# Altium schematic sheet FPGA_CLKs.SchDoc
size A3 portrait; PageSetup: Record=PageOptions|CenterHorizontal=True|CenterVertical=True|PrintScale=1.00|XCorrection=1.00|YCorrection=1.00|PrintKind=1|BorderSize=5000000|LeftOffset=0|BottomOffset=0|Orientation=1|PaperLength=1000|PaperWidth=1000|Scale=100|PaperSource=7|PrintQuality=-4|MediaType=1|DitherType=10|PaperKind=A4|PrintScaleMode=1
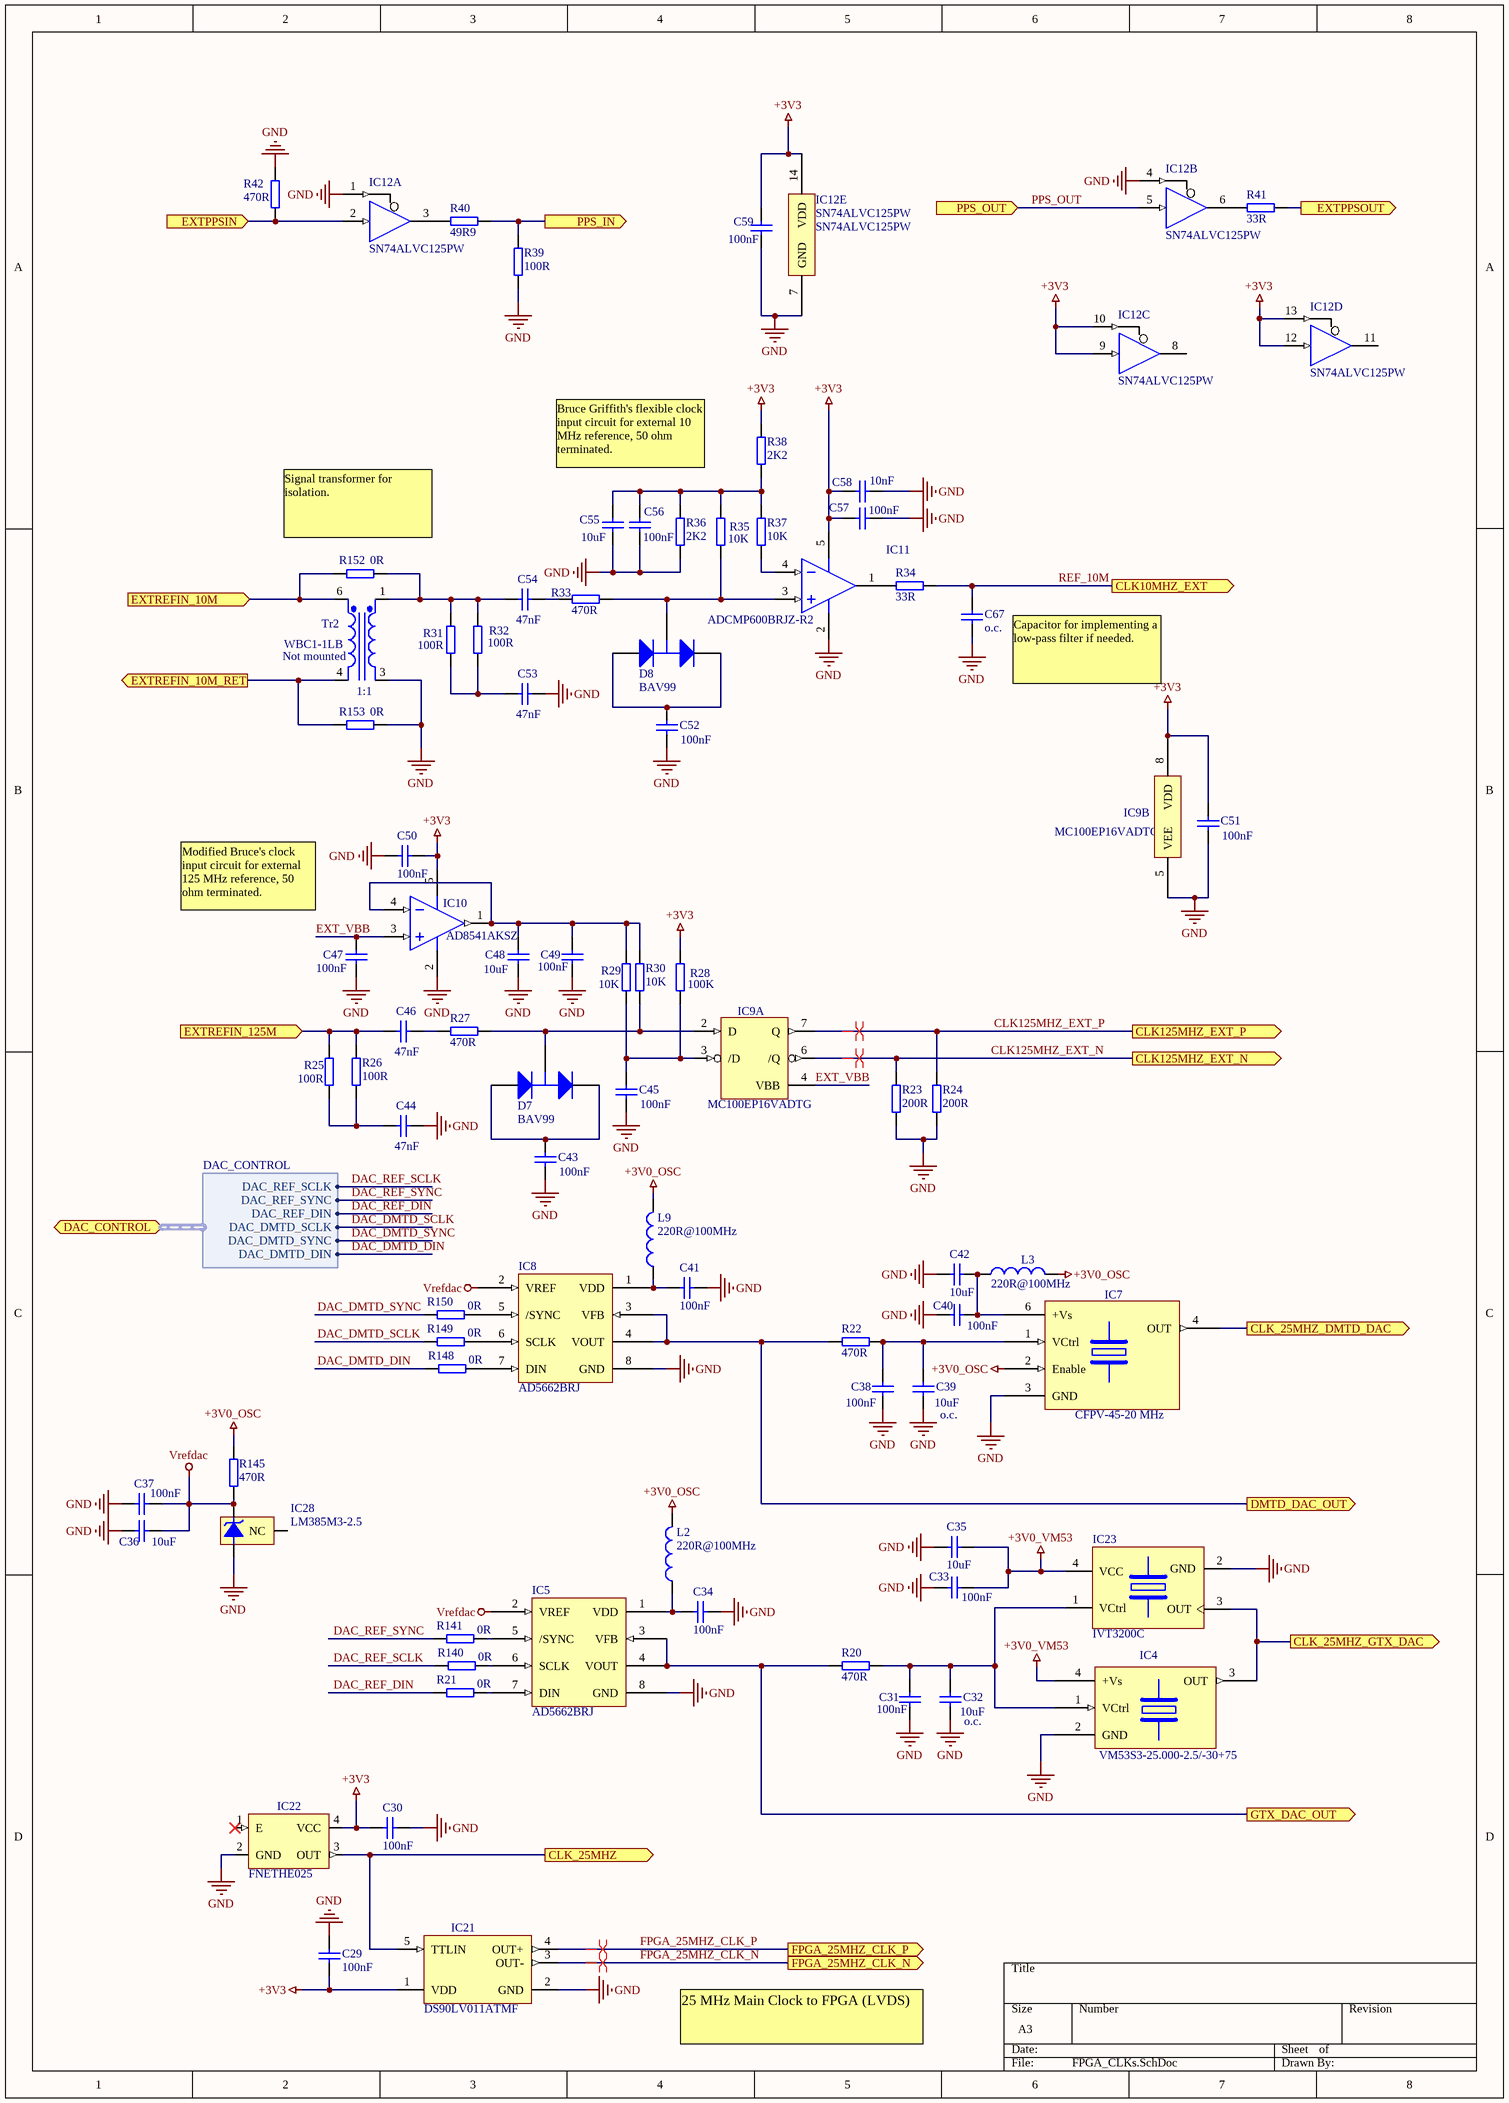
[diagram p0: FPGA_CLKs.SchDoc]

## Parts
C29  100nF  [CC1005-0402]
C30  100nF  [CC1005-0402]
C31  100nF  [CC1005-0402]
C32  10uF  value o.c.  [CC1608-0603]
C33  100nF  [CC1005-0402]
C34  100nF  [CC1005-0402]
C35  10uF  [CC1608-0603]
C36  10uF  [CC1608-0603]
C37  100nF  [CC1005-0402]
C38  100nF  [CC1005-0402]
C39  10uF  value o.c.  [CC1608-0603]
C40  100nF  [CC1005-0402]
C41  100nF  [CC1005-0402]
C42  10uF  [CC1608-0603]
C43  100nF  [CC1005-0402]
C44  47nF  [CC1005-0402]
C45  100nF  [CC1005-0402]
C46  47nF  [CC1005-0402]
C47  100nF  [CC1005-0402]
C48  10uF  [CC1608-0603]
C49  100nF  [CC1005-0402]
C50  100nF  [CC1005-0402]
C51  100nF  [CC1005-0402]
C52  100nF  [CC1005-0402]
C53  47nF  [CC1005-0402]
C54  47nF  [CC1005-0402]
C55  10uF  [CC1608-0603]
C56  100nF  [CC1005-0402]
C57  100nF  [CC1005-0402]
C58  10nF  [CC1005-0402]
C59  100nF  [CC1005-0402]
C67  o.c.  [CC1608-0603]
D7  BAV99  [SOT-23]
D8  BAV99  [SOT-23]
IC4  VM53S3-25.000-2.5/-30+75  [VCTCXO_VM53S]
IC5  value AD5662BRJ  [SOT23-8]  (hidden comment: AD5662B)
IC7  CFPV-45-20 MHz  [vs-705]
IC8  value AD5662BRJ  [SOT23-8]  (hidden comment: AD5662B)
IC9  value MC100EP16VADTG  [TSOP65P490-8AN]  (hidden comment: MC100EP16)  (parts A,B of 2)
IC10  AD8541AKSZ  [SOT65P210X110-5N]
IC11  ADCMP600BRJZ-R2  [SOT23-5AL]
IC12  SN74ALVC125PW  [PW014]  (parts A,B,C,D,E of 5)
IC21  DS90LV011ATMF  [MF05A_N]
IC22  FNETHE025  [SPXO]
IC23  IVT3200C  [OSC_RAKON_IVT3200C]
IC28  LM385M3-2.5  [MF03A_N]
L2  Impedance: 220R@100MHz  [0603]  (hidden comment: 220R@100MHz Ferrite Bead)
L3  Impedance: 220R@100MHz  [0603]  (hidden comment: 220R@100MHz Ferrite Bead)
L9  Impedance: 220R@100MHz  [0603]  (hidden comment: 220R@100MHz Ferrite Bead)
R20  470R  [0402]
R21  0R  [0603]
R22  470R  [0402]
R23  200R  [0402]
R24  200R  [0402]
R25  100R  [0402]
R26  100R  [0402]
R27  470R  [0402]
R28  100K  [0402]
R29  10k  [0402]
R30  10k  [0402]
R31  100R  [0402]
R32  100R  [0402]
R33  470R  [0402]
R34  33R  [0603]
R35  10k  [0402]
R36  2K2  [0402]
R37  10k  [0402]
R38  2K2  [0402]
R39  100R  [0402]
R40  49R9  [0603]
R41  33R  [0603]
R42  470R  [0402]
R140  0R  [0603]
R141  0R  [0603]
R145  470R  [0402]
R148  0R  [0603]
R149  0R  [0603]
R150  0R  [0603]
R152  value 0R  [0402]  (hidden comment: Jumper)
R153  value 0R  [0402]  (hidden comment: Jumper)
Tr2  WBC1-1LB  value 1:1  Mounted: Not mounted  [SMT6P150P]

## Ports
CLK10MHZ_EXT (out), CLK125MHZ_EXT_N (out), CLK125MHZ_EXT_P (out), CLK_25MHZ (out), CLK_25MHZ_DMTD_DAC (out), CLK_25MHZ_GTX_DAC (out), DAC_CONTROL (harness DAC_CONTROL), DMTD_DAC_OUT (out), EXTPPSIN (in), EXTPPSOUT (out), EXTREFIN_10M (in), EXTREFIN_10M_RET (out), EXTREFIN_125M (in), FPGA_25MHZ_CLK_N (out), FPGA_25MHZ_CLK_P (out), GTX_DAC_OUT (out), PPS_IN (out), PPS_OUT (in)

## Harnesses
DAC_CONTROL: DAC_DMTD_DIN, DAC_DMTD_SYNC, DAC_DMTD_SCLK, DAC_REF_DIN, DAC_REF_SYNC, DAC_REF_SCLK

## Nets
+3V0_OSC: IC7.2(Enable) L2.2 L3.2 L9.2 R145.2
+3V0_VM53: C33.1 C35.1 IC4.4(+Vs) IC23.4(VCC)
+3V3: C29.2 C30.2 C50.1 C51.2 C57.2 C58.2 C59.2 IC9.8(VDD) IC10.5(V+) IC11.5(VCC/VCCO) IC12.9(B) IC12.10(~{A}) IC12.12(B) IC12.13(~{A}) IC12.14(VDD) IC21.1(VDD) IC22.4(VCC) R28.2 R38.2
GND: C29.1 C30.1 C31.1 C32.1 C33.2 C34.1 C35.2 C36.1 C37.2 C38.1 C39.1 C40.2 C41.1 C42.2 C43.1 C44.2 C45.1 C47.1 C48.1 C49.1 C50.2 C51.1 C52.1 C53.2 C55.1 C56.1 C57.1 C58.1 C59.1 C67.1 IC4.2(GND) IC5.8(GND) IC7.3(GND) IC8.8(GND) IC9.5(VEE) IC10.2(V-) IC11.2(VEE) IC12.1(~{A}) IC12.4(~{A}) IC12.7(GND) IC21.2(GND) IC22.2(GND) IC23.2(GND) IC28.2(-V) R23.1 R24.1 R36.1 R39.1 R42.2 R153.1 Tr2.3(Sec-)
Vrefdac: C36.2 C37.1 IC5.2(VREF) IC8.2(VREF) IC28.1(+V) R145.1
CLK125MHZ_EXT_N: IC9.6(/Q) R23.2 ; port CLK125MHZ_EXT_N
CLK125MHZ_EXT_P: IC9.7(Q) R24.2 ; port CLK125MHZ_EXT_P
CLK_25MHZ: IC21.5(TTLIN) IC22.3(OUT) ; port CLK_25MHZ
CLK_25MHZ_DMTD_DAC: IC7.4(OUT) ; port CLK_25MHZ_DMTD_DAC
CLK_25MHZ_GTX_DAC: IC4.3(OUT) IC23.3(OUT) ; port CLK_25MHZ_GTX_DAC
DAC_DMTD_DIN: R148.2 ; port DAC_CONTROL.DAC_DMTD_DIN
DAC_DMTD_SCLK: R149.2 ; port DAC_CONTROL.DAC_DMTD_SCLK
DAC_DMTD_SYNC: R150.2 ; port DAC_CONTROL.DAC_DMTD_SYNC
DAC_REF_DIN: R21.2 ; port DAC_CONTROL.DAC_REF_DIN
DAC_REF_SCLK: R140.2 ; port DAC_CONTROL.DAC_REF_SCLK
DAC_REF_SYNC: R141.2 ; port DAC_CONTROL.DAC_REF_SYNC
DMTD_DAC_OUT: IC8.3(VFB) IC8.4(VOUT) R22.1 ; port DMTD_DAC_OUT
EXT_VBB: C47.2 IC9.4(VBB) IC10.3(IN+)
EXTPPSIN: IC12.2(B) R42.1 ; port EXTPPSIN
EXTPPSOUT: R41.2 ; port EXTPPSOUT
EXTREFIN_10M: R152.2 Tr2.6(Pri+) ; port EXTREFIN_10M
EXTREFIN_10M_RET: R153.2 Tr2.4(Pri-) ; port EXTREFIN_10M_RET
EXTREFIN_125M: C46.1 R25.2 R26.2 ; port EXTREFIN_125M
FPGA_25MHZ_CLK_N: IC21.3(OUT-) ; port FPGA_25MHZ_CLK_N
FPGA_25MHZ_CLK_P: IC21.4(OUT+) ; port FPGA_25MHZ_CLK_P
GTX_DAC_OUT: IC5.3(VFB) IC5.4(VOUT) R20.1 ; port GTX_DAC_OUT
PPS_IN: R39.2 R40.2 ; port PPS_IN
PPS_OUT: IC12.5(B) ; port PPS_OUT
REF_10M: C67.2 R34.2 ; port CLK10MHZ_EXT
NetC31_2: C31.2 C32.2 IC4.1(VCtrl) IC23.1(VCtrl) R20.2
NetC34_2: C34.2 IC5.1(VDD) L2.1
NetC38_2: C38.2 C39.2 IC7.1(VCtrl) R22.2
NetC40_1: C40.1 C42.1 IC7.6(+Vs) L3.1
NetC41_2: C41.2 IC8.1(VDD) L9.1
NetC43_2: C43.2 D7.1(A) D7.2(K)
NetC44_1: C44.1 R25.1 R26.1
NetC45_2: C45.2 IC9.3(/D) R28.1 R29.1
NetC46_2: C46.2 R27.1
NetC48_2: C48.2 C49.2 IC10.1(OUT) IC10.4(IN-) R29.2 R30.2
NetC52_2: C52.2 D8.1(A) D8.2(K)
NetC53_1: C53.1 R31.1 R32.1
NetC54_1: C54.1 R31.2 R32.2 R152.1 Tr2.1(Sec+)
NetC54_2: C54.2 R33.1
NetC55_2: C55.2 C56.2 R35.2 R36.2 R37.2 R38.1
NetD7_3: D7.3(C) IC9.2(D) R27.2 R30.1
NetD8_3: D8.3(C) IC11.3(VP) R33.2 R35.1
NetIC5_5: IC5.5(/SYNC) R141.1
NetIC5_6: IC5.6(SCLK) R140.1
NetIC5_7: IC5.7(DIN) R21.1
NetIC8_5: IC8.5(/SYNC) R150.1
NetIC8_6: IC8.6(SCLK) R149.1
NetIC8_7: IC8.7(DIN) R148.1
NetIC11_1: IC11.1(Q) R34.1
NetIC11_4: IC11.4(VN) R37.1
NetIC12_3: IC12.3(Y) R40.1
NetIC12_6: IC12.6(Y) R41.1

Not connected (* = marked no-connect by the designer): IC12 8(Y) 11(Y); IC22 1(E)*; IC28 3(NC)

## Layout directives
differential pair: CLK125MHZ_EXT_N, CLK125MHZ_EXT_P, FPGA_25MHZ_CLK_N, FPGA_25MHZ_CLK_P

## Notes on the sheet
- Bruce Griffith's flexible clock input circuit for external 10 MHz reference, 50 ohm terminated.
- (near R152) Signal transformer for isolation.
- (near C67) Capacitor for implementing a low-pass filter if needed.
- Modified Bruce's clock input circuit for external 125 MHz reference, 50 ohm terminated.
- 25 MHz Main Clock to FPGA (LVDS)

## Library data of the parts
C29-C31 C33 C34 C37 C38 C40 C41 C43 C45 C47 C49-C52 C56 C57 C59 = CC0402_100NF_16V_10%_X7R: Capacitor; Manufacturer1: TDK; Manufacturer1 PN: C1005X7R1C104K; TC: X7R; Tolerance: ±10%; Voltage: 16V; Published: 8-Jun-2000; LatestRevisionDate: 17-Jul-2002; LatestRevisionNote: Re-released for DXP Platform.; PackageReference: RAD-0.3; Publisher: Altium Limited; Distributor1: Digikey; Distributor1 PN: 445-4952-1-ND; Case: 0402; Value: 100nF
C32 C35 C36 C39 C42 C48 C55 = CC0603_10UF_6.3V_20%_X5R: Capacitor; Manufacturer1: TDK; Manufacturer1 PN: C1608X5R0J106M; TC: X5R; Tolerance: ±20%; Voltage: 6.3V; Published: 8-Jun-2000; LatestRevisionDate: 17-Jul-2002; LatestRevisionNote: Re-released for DXP Platform.; PackageReference: RAD-0.3; Publisher: Altium Limited; Distributor1: Digikey; Distributor1 PN: 445-4112-1-ND; Case: 0603
  C35 C36 C42 C48 C55: Value: 10uF
C44 C46 C53 C54 = CC0402_47NF_25V_10%_X7R: Capacitor; Manufacturer1: TDK; Manufacturer1 PN: C1005X7R1E473K; TC: X7R; Tolerance: ±10%; Voltage: 25V; Published: 8-Jun-2000; LatestRevisionDate: 17-Jul-2002; LatestRevisionNote: Re-released for DXP Platform.; PackageReference: RAD-0.3; Publisher: Altium Limited; Distributor1: Digikey; Distributor1 PN: 445-4941-1-ND; Case: 0402; Value: 47nF
C58 = CC0402_10NF_25V_10%_X7R: Capacitor; Manufacturer1: TDK; Manufacturer1 PN: C1005X7R1E103K; TC: X7R; Tolerance: ±10%; Voltage: 25V; Published: 8-Jun-2000; LatestRevisionDate: 17-Jul-2002; LatestRevisionNote: Re-released for DXP Platform.; PackageReference: RAD-0.3; Publisher: Altium Limited; Distributor1: Digikey; Distributor1 PN: 445-1260-1-ND; Case: 0402; Value: 10nF
C67 = CC0603_O.C.: Capacitor; Manufacturer1: Phycomp; TC: X7R; Tolerance: ±10%; Voltage: 16V; Published: 8-Jun-2000; LatestRevisionDate: 17-Jul-2002; LatestRevisionNote: Re-released for DXP Platform.; PackageReference: RAD-0.3; Publisher: Altium Limited; Manufacturer1 PN: *; Distributor1: Digikey; Distributor1 PN: *; Case: 0402; Value: o.c.
D7 D8 = BAV99: Silicon Switching Diode Array for High-Speed Switching; RefId: 1081211; Published: 21-Mar-2003; DatasheetDocument: Oct-1999; PackageDocument: Sep-2001; PackageReference: SOT-23; Publisher: Altium Limited; ComponentLink1Description: Manufacturer Link; ComponentLink1URL: http://www.infineon.com/; ComponentLink2Description: Datasheet; ComponentLink2URL: http://www.infineon.com/upload/Document/cmc_upload/documents/080/631/bav99series_1.pdf; Supplier: Farnell; Value: BAV99
IC4 = VCTCXO_VM53S: VCTCXO oscillator; Manufacturer1: MEC; Distributor1: RS; Distributor1 PN: 672-0797
IC5 IC8 = AD5662BRJ: Analog Devices 16-bit DAC w/SPI interface, ext ref; RefId: AD5662BRJZ-2REEL7DKR-ND; Supplier: Digikey
IC7 = VCXO_CFPV_45: VCXO oscillator; Manufacturer: IQD Frequency; Manufacturer PN: LFVCXO026156; Distributor1: Farnell; Distributor1 PN: 1674677
IC9 = MC100EP16: ONSemi differental receiver w/ECL output; RefId: 1607606; Supplier: Farnell
IC10 = AD8541: Analog Devices general purpose low-voltage R2R CMOS opamp; Value: AD8541AKSZ; Distributor1: Digikey; Distributor1 PN: AD8541AKSZ-REEL7CT-ND
IC11 = ADCMP600: Analog Devices fast comparator; RefId: 1441023; Supplier: Farnell; Value: ADCMP600BRJZ-R2
IC12 = SN74ALVC125PW: Quad Buffer with 3-State Outputs with TTL Compatible Inputs; Manufacturer1: Texas Instruments; Value: SN74ALVC125PW; Manufacturer1 PN: SN74ALVC125PW; Distributor1: Digikey; Distributor1 PN: 296-26434-5-ND; Case: PW14
IC21 = DS90LV011ATMF: Single High Speed Differential Driver; Manufacturer: National Semiconductor; CompType: Interface IC; PackageTopMarking: N01*XTT; PowerWise: N; Published: 4-Dec-2008; DatasheetVersion: May-2002; PackageVersion: revD, Aug-2008; PackageReference: MF05A; Publisher: Altium Limited; PackageDescription: Molded SOT-23, .115 x .063 x .040in Body, 5 Lead, .0375in Pitch; PartNumber: DS90LV011ATMF; RoHS: O; PinCount: 5; DigiKeyPartNumber: DS90LV011ATMFTR-ND; ComponentLink1Description: DS90LV011A Datasheet; ComponentLink1URL: http://www.national.com/ds/DS/DS90LV011A.pdf; ComponentLink2Description: DS90LV011A Web Page; ComponentLink2URL: http://www.national.com/pf/DS/DS90LV011A.html; ComponentLink3Description: MF05A Package Page; ComponentLink3URL: http://www.national.com/packaging/folders/mf05a.html
IC22 = OSC_CFPS-73: SMD oscillator 3.3V (Elfa); Value: FNETHE025; Distributor: Digikey; Distributor PN: FNETHE025CT-ND
IC23 = IVT32000C
IC28 = LM385M3-2.5: Micropower Voltage Reference Diode; Manufacturer: National Semiconductor; CompType: Voltage Reference IC; PackageTopMarking: R12*XTT; Published: 4-Dec-2008; DatasheetVersion: Jan-2008; PackageVersion: revB, Mar-2003; PackageReference: MF03A; Publisher: Altium Limited; PackageDescription: Molded SOT-23, .115 x .051 x .037in Body, 3 Lead, .075 in Pitch; PartNumber: LM385M3-2.5; RoHS: O; PinCount: 3; DigiKeyPartNumber: LM385M3-2.5CT-ND; ComponentLink1Description: LM385-2.5 Datasheet; ComponentLink1URL: http://www.national.com/ds/LM/LM385-2.5.pdf; ComponentLink2Description: LM385-2.5 Web Page; ComponentLink2URL: http://www.national.com/pf/LM/LM385-2.5.html; ComponentLink3Description: MF03A Package Page; ComponentLink3URL: http://www.national.com/packaging/folders/mf03a.html
L2 L3 L9 = L_FERRITE_BEAD: ferrite bead; Manufacturer1: Murata; Manufacturer1 PN: BLM18KG221SN1D; Current Rating: 2.2A; DCR: 50mOhm; Case: 0603; Distributor1: Digikey; Distributor1 PN: 490-5255-1-ND
R20 R22 R27 R33 R42 R145 = R0402_470R_±1%_0.1W_100PPM: SMD Resistor; Manufacturer1: Panasonic; Manufacturer1 PN: ERJ-2RKF4700X; TCR: 100ppm; Power Rating: 0.1W; Tolerance: ±1%; Case: 0402; Distributor1: DigiKey; Distributor1 PN: P470LCT-ND; Value: 470R
R21 R140 R141 R148-R150 = R0603_0R_0.1W_JUMPER: SMD Resistor; Manufacturer1: Yageo; Manufacturer1 PN: RC0603JR-070RL; TCR: 200ppm; Power Rating: 0.1W; Case: 0603; Distributor1: DigiKey; Distributor1 PN: 311-0.0GRCT-ND; Tolerance: -; Value: 0R
R23 R24 = R0402_200R_±1%_0.1W_100PPM: SMD Resistor; Manufacturer1: Panasonic; Manufacturer1 PN: ERJ-2RKF2000X; TCR: 100ppm; Power Rating: 0.1W; Tolerance: ±1%; Case: 0402; Distributor1: DigiKey; Distributor1 PN: P200LCT-ND; Value: 200R
R25 R26 R31 R32 R39 = R0402_100R_±1%_0.1W_100PPM: SMD Resistor; Manufacturer1: Panasonic; Manufacturer1 PN: ERJ-2RKF1000X; TCR: 100ppm; Power Rating: 0.1W; Tolerance: ±1%; Case: 0402; Distributor1: DigiKey; Distributor1 PN: P100LCT-ND; Value: 100R
R28 = R0402_100K_±1%_0.1W_100PPM: SMD Resistor; Manufacturer1: Panasonic; Manufacturer1 PN: ERJ-2RKF1003X; TCR: 100ppm; Power Rating: 0.1W; Tolerance: ±1%; Case: 0402; Distributor1: DigiKey; Distributor1 PN: P100KLCT-ND; Value: 100K
R29 R30 R35 R37 = R0402_10K_±1%_0.1W_100PPM: SMD Resistor; Manufacturer1: Panasonic; Manufacturer1 PN: ERJ-2RKF1002X; TCR: 100ppm; Power Rating: 0.1W; Tolerance: ±1%; Case: 0402; Distributor1: DigiKey; Distributor1 PN: P10.0KLCT-ND; Value: 10K
R34 R41 = R0603_33R_±1%_0.25W_100PPM: SMD Resistor; Manufacturer1: Vishay/Dale; Manufacturer1 PN: CRCW060333R0FKEAHP; TCR: 100ppm; Power Rating: 0.25W; Tolerance: ±1%; Distributor1: DigiKey; Distributor1 PN: 541-33.0SCT-ND; Value: 33R
  R34: Case: 0603
  R41: Case: 0402
R36 R38 = R0402_2K2_±1%_0.1W_100PPM: SMD Resistor; Manufacturer1: Panasonic; Manufacturer1 PN: ERJ-2RKF2201X; TCR: 100ppm; Power Rating: 0.1W; Tolerance: ±1%; Case: 0402; Distributor1: DigiKey; Distributor1 PN: P2.20KLCT-ND; Value: 2K2
R40 = R0603_49R9_±1%_0.25W_100PPM: SMD Resistor; Manufacturer1: Vishay/Dale; Manufacturer1 PN: CRCW060349R9FKEAHP; TCR: 100ppm; Power Rating: 0.25W; Tolerance: ±1%; Case: 0603; Distributor1: DigiKey; Distributor1 PN: 541-49.9SCT-ND; Value: 49R9
R152 R153 = R0402_0R_0.1W_JUMPER: SMD Resistor; Manufacturer1: Panasonic; Manufacturer1 PN: ERJ-2GE0R00X; TCR: 100ppm; Power Rating: 0.1W; Case: 0402; Distributor1: DigiKey; Distributor1 PN: P0.0JCT-ND; Tolerance: Jumper
Tr2 = WBC1-1LB: SMT Mini WideBand Transformer 1:1, 10uH,; Manufacturer: Coilcraft; Published: 8-Jun-2000; LatestRevisionDate: 17-Jul-2002; LatestRevisionNote: Re-released for DXP Platform.; PackageReference: TRF_4; Publisher: Altium Limited; Manufacturer PN: WBC1-1LB